# Altium schematic sheet Main.SchDoc
size Legal; Author: Mark & Qiming; DocumentNumber: 1; SheetNumber: 1; SheetTotal: 9
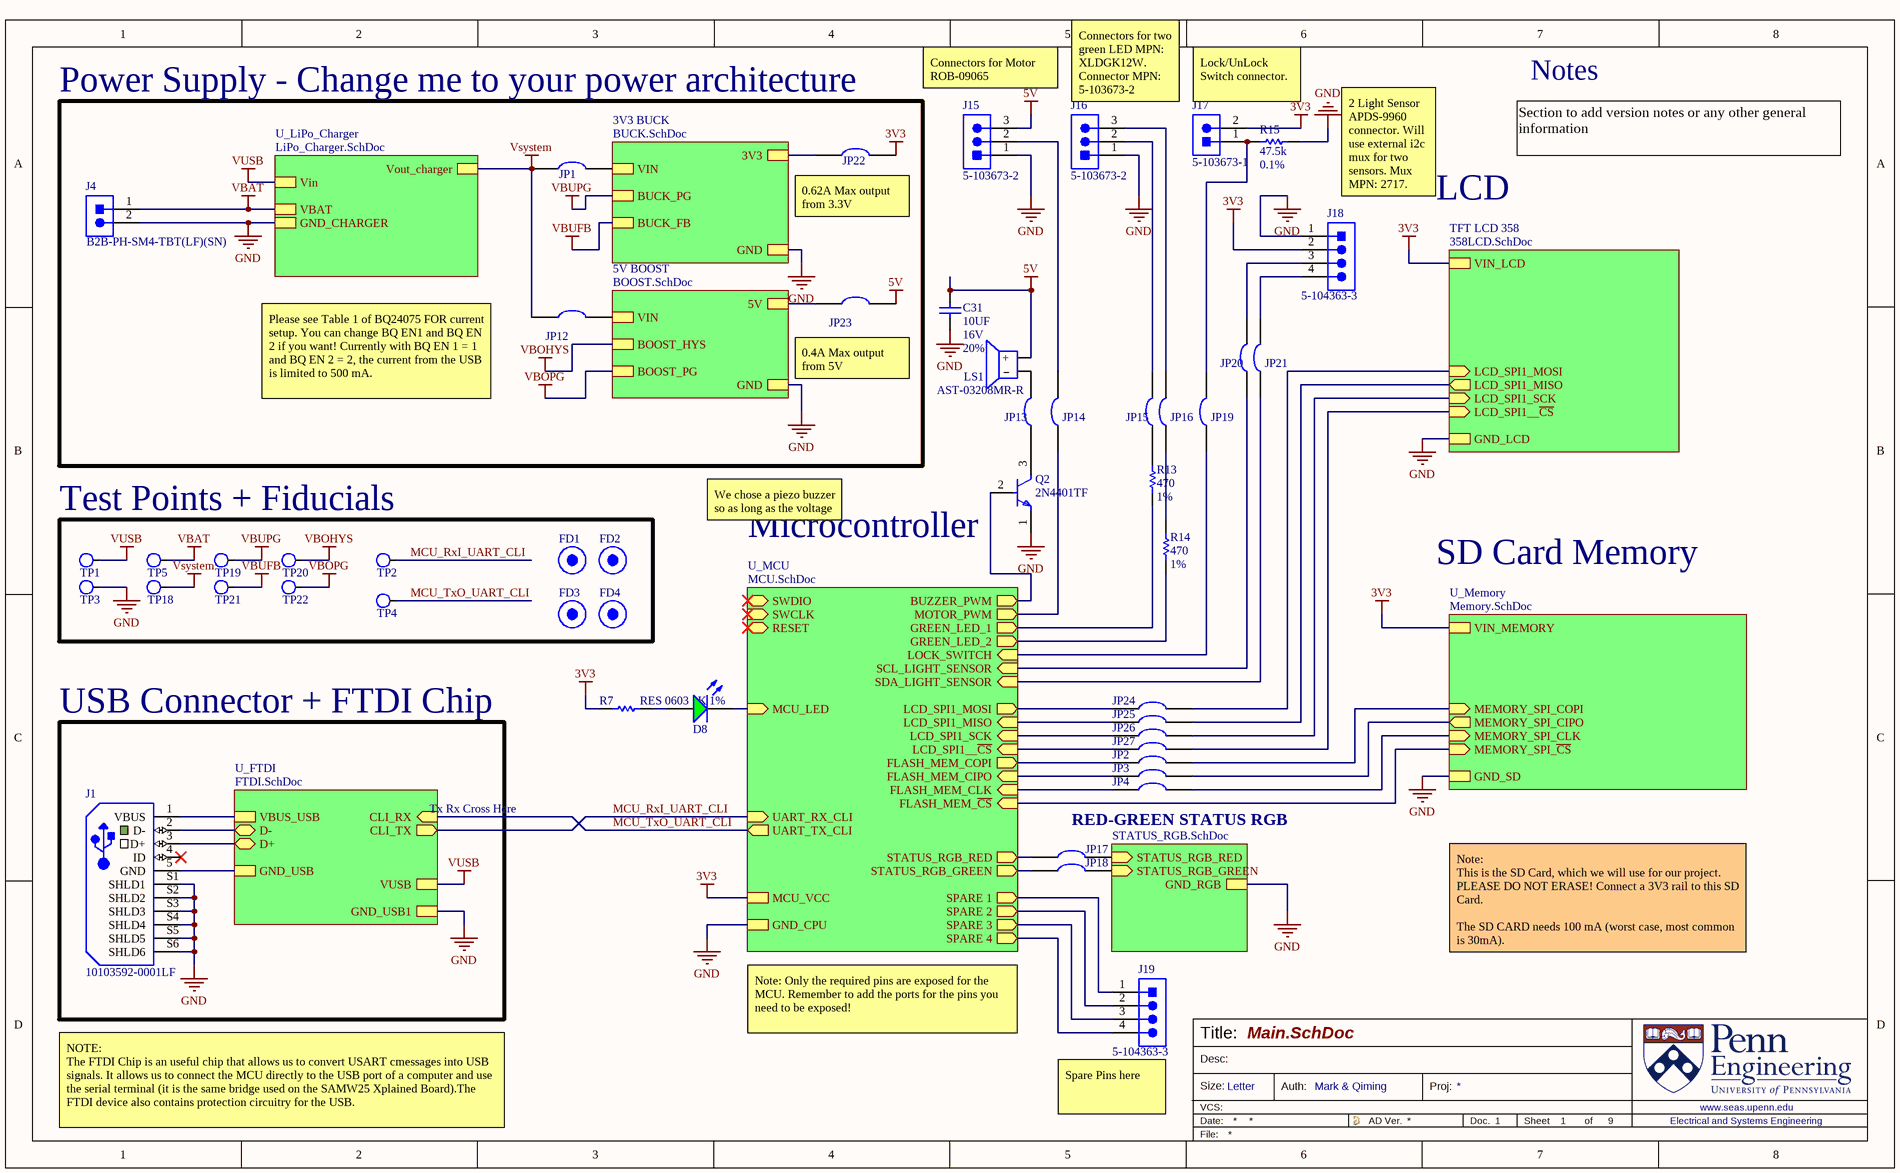
[diagram p0: Main.SchDoc]

## Parts
C31  value 10UF  Voltage: 16V  Tolerance: 20%  [0603_CAP]  (hidden comment: CAP 0603 10UF 16V 20% X5R)
D8  LSM0805452V  [LED_0805]  (value not drawn)
FD1  Fiducial 40x100mm  [Fiducial 40x100mm-Footprint-1]  (value not drawn)  (no BOM)
FD2  Fiducial 40x100mm  [Fiducial 40x100mm-Footprint-1]  (value not drawn)  (no BOM)
FD3  Fiducial 40x100mm  [Fiducial 40x100mm-Footprint-1]  (value not drawn)  (no BOM)
FD4  Fiducial 40x100mm  [Fiducial 40x100mm-Footprint-1]  (value not drawn)  (no BOM)
J1  10103592-0001LF  [10103592-0001LF-Footprint-1]
J4  B2B-PH-SM4-TBT(LF)(SN)  [FP-B2B-PH-SM4-TBT_LF_SN-MFG]
J15  5-103673-2  [5-103673-2-Footprint-1]
J16  5-103673-2  [5-103673-2-Footprint-1]
J17  5-103673-1  [5-103672-1-Footprint-1]
J18  5-104363-3  [5-104363-3-Footprint-1]
J19  5-104363-3  [5-104363-3-Footprint-1]
JP1  0603 link  [0603_JP_RES]  (value not drawn)  (net tie, no BOM)
JP2  0603 link  [0603_JP_RES]  (value not drawn)  (net tie, no BOM)
JP3  0603 link  [0603_JP_RES]  (value not drawn)  (net tie, no BOM)
JP4  0603 link  [0603_JP_RES]  (value not drawn)  (net tie, no BOM)
JP12  0603 link  [0603_JP_RES]  (value not drawn)  (net tie, no BOM)
JP13  0603 link  [0603_JP_RES]  (value not drawn)  (net tie, no BOM)
JP14  0603 link  [0603_JP_RES]  (value not drawn)  (net tie, no BOM)
JP15  0603 link  [0603_JP_RES]  (value not drawn)  (net tie, no BOM)
JP16  0603 link  [0603_JP_RES]  (value not drawn)  (net tie, no BOM)
JP17  0603 link  [0603_JP_RES]  (value not drawn)  (net tie, no BOM)
JP18  0603 link  [0603_JP_RES]  (value not drawn)  (net tie, no BOM)
JP19  0603 link  [0603_JP_RES]  (value not drawn)  (net tie, no BOM)
JP20  0603 link  [0603_JP_RES]  (value not drawn)  (net tie, no BOM)
JP21  0603 link  [0603_JP_RES]  (value not drawn)  (net tie, no BOM)
JP22  0603 link  [0603_JP_RES]  (value not drawn)  (net tie, no BOM)
JP23  0603 link  [0603_JP_RES]  (value not drawn)  (net tie, no BOM)
JP24  0603 link  [0603_JP_RES]  (value not drawn)  (net tie, no BOM)
JP25  0603 link  [0603_JP_RES]  (value not drawn)  (net tie, no BOM)
JP26  0603 link  [0603_JP_RES]  (value not drawn)  (net tie, no BOM)
JP27  0603 link  [0603_JP_RES]  (value not drawn)  (net tie, no BOM)
LS1  AST-03208MR-R  [AST-03208MR-R]
Q2  2N4401TF  [FP-135AR-MFG]
R7  RES 0603 1K 1%  [0603_RES]
R13  value 470  Tolerance: 1%  [0805_RES]  (hidden comment: RES 0805 470 1%)
R14  value 470  Tolerance: 1%  [0805_RES]  (hidden comment: RES 0805 470 1%)
R15  value 47.5k  Tolerance: 0.1%  [0805_RES]  (hidden comment: RES 0805 47.5K 0.1%)
TP1  Testpad  [SMT Testpoint, 50mil]  (value not drawn)  (no BOM)
TP2  Testpad  [SMT Testpoint, 50mil]  (value not drawn)  (no BOM)
TP3  Testpad  [SMT Testpoint, 50mil]  (value not drawn)  (no BOM)
TP4  Testpad  [SMT Testpoint, 50mil]  (value not drawn)  (no BOM)
TP5  Testpad  [Test PTH 27-50]  (value not drawn)  (no BOM)
TP18  Testpad  [Test PTH 27-50]  (value not drawn)  (no BOM)
TP19  Testpad  [SMT Testpoint, 50mil]  (value not drawn)  (no BOM)
TP20  Testpad  [SMT Testpoint, 50mil]  (value not drawn)  (no BOM)
TP21  Testpad  [SMT Testpoint, 50mil]  (value not drawn)  (no BOM)
TP22  Testpad  [SMT Testpoint, 50mil]  (value not drawn)  (no BOM)

## Blocks framed on the sheet
Power Supply - Change me to your power architecture: J4 JP1 JP12 JP22 JP23
Test Points + Fiducials: FD1-FD4 TP1-TP5 TP18-TP22
USB Connector + FTDI Chip: J1

## Sub-sheets
3V3 BUCK = BUCK.SchDoc: 3V3, VIN, BUCK_PG, BUCK_FB, GND
5V BOOST = BOOST.SchDoc: VIN, 5V, BOOST_HYS, BOOST_PG, GND
RED-GREEN STATUS RGB = STATUS_RGB.SchDoc: STATUS_RGB_RED (in), STATUS_RGB_GREEN (in), GND_RGB
TFT LCD 358 = 358LCD.SchDoc: LCD_SPI1_MOSI (in), LCD_SPI1_MISO (out), LCD_SPI1__~{CS} (in), LCD_SPI1_SCK (in), GND_LCD, VIN_LCD
U_FTDI = FTDI.SchDoc: CLI_RX (in), CLI_TX (out), VUSB, GND_USB1, VBUS_USB, D- (bidir), D+ (bidir), GND_USB
U_LiPo_Charger = LiPo_Charger.SchDoc: Vin, GND_CHARGER, VBAT, Vout_charger
U_MCU = MCU.SchDoc: SWDIO (bidir), SWCLK (in), UART_TX_CLI (out), UART_RX_CLI (in), RESET (bidir), MCU_LED (in), MCU_VCC, GND_CPU, FLASH_MEM_~{CS} (in), FLASH_MEM_CLK (in), FLASH_MEM_CIPO (in), FLASH_MEM_COPI (out), MOTOR_PWM (out), GREEN_LED_1 (out), GREEN_LED_2 (out), BUZZER_PWM (out), STATUS_RGB_GREEN (out), STATUS_RGB_RED (out), LOCK_SWITCH (in), SCL_LIGHT_SENSOR (in), SDA_LIGHT_SENSOR (in), LCD_SPI1_SCK (in), LCD_SPI1__~{CS} (in), LCD_SPI1_MOSI (out), LCD_SPI1_MISO (in), SPARE 1 (out), SPARE 2 (out), SPARE 3 (out), SPARE 4 (out)
U_Memory = Memory.SchDoc: MEMORY_SPI_COPI (in), MEMORY_SPI_CIPO (out), MEMORY_SPI_CLK (in), MEMORY_SPI_~{CS} (in), VIN_MEMORY, GND_SD

## Nets
3V3: J17.2 J18.2 JP22.2 R7.2 ; sheet U_MCU/MCU_VCC, sheet U_Memory/VIN_MEMORY, sheet TFT LCD 358/VIN_LCD
5V: C31.2 J15.3 JP23.2 LS1.1(+)
GND: C31.1 J1.S1(SHLD1) J1.S2(SHLD2) J1.S3(SHLD3) J1.S4(SHLD4) J1.S5(SHLD5) J1.S6(SHLD6) J4.2 J15.1 J16.1 J18.1 Q2.1(E) R15.2 TP3.1 ; sheet U_FTDI/GND_USB1, sheet U_MCU/GND_CPU, sheet U_LiPo_Charger/GND_CHARGER, sheet U_Memory/GND_SD, sheet 3V3 BUCK/GND, sheet 5V BOOST/GND, sheet RED-GREEN STATUS RGB/GND_RGB, sheet TFT LCD 358/GND_LCD
VBAT: J4.1 TP5.1 ; sheet U_LiPo_Charger/VBAT
VBOHYS: TP20.1 ; sheet 5V BOOST/BOOST_HYS
VBOPG: TP22.1 ; sheet 5V BOOST/BOOST_PG
VBUFB: TP21.1 ; sheet 3V3 BUCK/BUCK_FB
VBUPG: TP19.1 ; sheet 3V3 BUCK/BUCK_PG
Vsystem: JP1.1 JP12.1 TP18.1 ; sheet U_LiPo_Charger/Vout_charger
VUSB: TP1.1 ; sheet U_FTDI/VUSB, sheet U_LiPo_Charger/Vin
MCU_RxI_UART_CLI: TP2.1 ; sheet U_FTDI/CLI_TX, sheet U_MCU/UART_RX_CLI
MCU_TxO_UART_CLI: TP4.1 ; sheet U_FTDI/CLI_RX, sheet U_MCU/UART_TX_CLI
NetD8_A: D8.A R7.1
NetD8_K: D8.K ; sheet U_MCU/MCU_LED
NetJ1_1: J1.1(VBUS) ; sheet U_FTDI/VBUS_USB
NetJ1_2: J1.2(D-) ; sheet U_FTDI/D-
NetJ1_3: J1.3(D+) ; sheet U_FTDI/D+
NetJ1_5: J1.5(GND) ; sheet U_FTDI/GND_USB
NetJ15_2: J15.2 JP14.2
NetJ16_2: J16.2 JP15.2
NetJ16_3: J16.3 JP16.2
NetJ17_1: J17.1 JP19.2 R15.1
NetJ18_3: J18.3 JP20.2
NetJ18_4: J18.4 JP21.2
NetJ19_1: J19.1 ; sheet U_MCU/SPARE 1
NetJ19_2: J19.2 ; sheet U_MCU/SPARE 2
NetJ19_3: J19.3 ; sheet U_MCU/SPARE 3
NetJ19_4: J19.4 ; sheet U_MCU/SPARE 4
NetJP1_2: JP1.2 ; sheet 3V3 BUCK/VIN
NetJP2_1: JP2.1 ; sheet U_MCU/FLASH_MEM_COPI
NetJP2_2: JP2.2 ; sheet U_Memory/MEMORY_SPI_COPI
NetJP3_1: JP3.1 ; sheet U_MCU/FLASH_MEM_CIPO
NetJP3_2: JP3.2 ; sheet U_Memory/MEMORY_SPI_CIPO
NetJP4_1: JP4.1 ; sheet U_MCU/FLASH_MEM_CLK
NetJP4_2: JP4.2 ; sheet U_Memory/MEMORY_SPI_CLK
NetJP12_2: JP12.2 ; sheet 5V BOOST/VIN
NetJP13_1: JP13.1 Q2.3(C)
NetJP13_2: JP13.2 LS1.2(‒)
NetJP14_1: JP14.1 ; sheet U_MCU/MOTOR_PWM
NetJP15_1: JP15.1 R13.2
NetJP16_1: JP16.1 R14.2
NetJP17_1: JP17.1 ; sheet U_MCU/STATUS_RGB_RED
NetJP17_2: JP17.2 ; sheet RED-GREEN STATUS RGB/STATUS_RGB_RED
NetJP18_1: JP18.1 ; sheet U_MCU/STATUS_RGB_GREEN
NetJP18_2: JP18.2 ; sheet RED-GREEN STATUS RGB/STATUS_RGB_GREEN
NetJP19_1: JP19.1 ; sheet U_MCU/LOCK_SWITCH
NetJP20_1: JP20.1 ; sheet U_MCU/SCL_LIGHT_SENSOR
NetJP21_1: JP21.1 ; sheet U_MCU/SDA_LIGHT_SENSOR
NetJP22_1: JP22.1 ; sheet 3V3 BUCK/3V3
NetJP23_1: JP23.1 ; sheet 5V BOOST/5V
NetJP24_1: JP24.1 ; sheet U_MCU/LCD_SPI1_MOSI
NetJP24_2: JP24.2 ; sheet TFT LCD 358/LCD_SPI1_MOSI
NetJP25_1: JP25.1 ; sheet U_MCU/LCD_SPI1_MISO
NetJP25_2: JP25.2 ; sheet TFT LCD 358/LCD_SPI1_MISO
NetJP26_1: JP26.1 ; sheet U_MCU/LCD_SPI1_SCK
NetJP26_2: JP26.2 ; sheet TFT LCD 358/LCD_SPI1_SCK
NetJP27_1: JP27.1 ; sheet U_MCU/LCD_SPI1__~{CS}
NetJP27_2: JP27.2 ; sheet TFT LCD 358/LCD_SPI1__~{CS}
NetQ2_2: Q2.2(B) ; sheet U_MCU/BUZZER_PWM
NetR13_1: R13.1 ; sheet U_MCU/GREEN_LED_1
NetR14_1: R14.1 ; sheet U_MCU/GREEN_LED_2
(unnamed): sheet U_MCU/FLASH_MEM_~{CS}, sheet U_Memory/MEMORY_SPI_~{CS}

Not connected (* = marked no-connect by the designer): FD1 0(PAD); FD2 0(PAD); FD3 0(PAD); FD4 0(PAD); J1 4(ID)*

## Notes on the sheet
- Connectors for Motor ROB-09065
- (near J16) Connectors for two green LED MPN: XLDGK12W. Connector MPN: 5-103673-2
- Lock/UnLock Switch connector.
- Notes
- Section to add version notes or any other general information
- (near JP22) 0.62A Max output from 3.3V
- 2 Light Sensor APDS-9960 connector. Will use external i2c mux for two sensors. Mux MPN: 2717.
- LCD
- 0.4A Max output from 5V
- Please see Table 1 of BQ24075 FOR current setup. You can change BQ EN1 and BQ EN 2 if you want! Currently with BQ EN 1 = 1 and BQ EN 2 = 2, the current from the USB is limited to 500 mA.
- We chose a piezo buzzer so as long as the voltage is correct and we limit the current it should be good
- (near Q2) Microcontroller
- SD Card Memory
- Tx Rx Cross Here
- Note:
  This is the SD Card, which we will use for our project. PLEASE DO NOT ERASE! Connect a 3V3 rail to this SD Card.
  The SD CARD needs 100 mA (worst case, most common is 30mA).
- Note: Only the required pins are exposed for the MCU. Remember to add the ports for the pins you need to be exposed!
- NOTE:
  The FTDI Chip is an useful chip that allows us to convert USART cmessages into USB signals. It allows us to connect the MCU directly to the USB port of a computer and use the serial terminal (it is the same bridge used on the SAMW25 Xplained Board).The FTDI device also contains protection circuitry for the USB.
- (near J19) Spare Pins here
- Title:
- Desc:
- Size:
- Letter
- Auth:
- Proj:
- Sheet
- of
- www.seas.upenn.edu
- Electrical and Systems Engineering

## Library data of the parts
C31 = CMP-011-000263-1: Capacitor Surface Mount 0603 Footprint 10UF 16V 20% Tolerance Ceramic X5R; Manufacturer: Various; Description in Visual: Cap SMT 0603 10UF 16V 20% Ceramic X5R; PCB Package: 0603; Type: Ceramic X5R; Mount: SMT; P/N: CAP 0603 10UF 16V 20% X5R; Manufacturer P/N: CAP 0603 10UF 16V 20% X5R
D8 = CMP-00038-3: Single Color LED, Green, 0805; Test Current: 20mA; Forward Voltage: 2V; RoHS Compliant: Yes
FD1 FD3 FD4 = CMP-00085-3
FD2 = CMP-00085-2
J1 = CMP-00092-5: Conn Micro USB 2.0 Type B RCP 5 POS 0.65mm Solder RA SMD 5 Terminal 1 Port T/R
J4 = CMP-00418-1: Connector Header, PH Series, 2 Position, 2.00mm, 100V, Surface Mount, Solder, Pick and Place, Natural.
J15 J16 = CMP-00385-1: Board Connector, 3 Contact(s), 1 Row(s), Male, Right Angle, Solder Terminal, Black Insulator; Option: General Purpose; MIL Conformance: No; Number of Contacts: 3; Mating Information: MULTIPLE MATING PARTS AVAILABLE; Number of Rows Loaded: 1; Additional Feature: POLARIZED; Flammability Rating: UL94 V-0; RoHS Compliant: Yes; JESD-609 Code: e3; Contact Finish - Mating: NOT SPECIFIED; Reach SVHC Compliant: Yes; Connector Type: BOARD CONNECTOR; Filter Feature: No; IEC Conformance: No; Mounting Style: RIGHT ANGLE; Terminal Pitch: 2.54mm; Contact Material: Brass; Termination: Solder; Mounting Technology: Board; Mixed Contacts: No; Contact Finish - Termination: TIN; Contact Gender: Male; DIN Conformance: No
J17 = CMP-00384-1: Board Connector, 2 Contact(s), 1 Row(s), Male, Right Angle, 0.1 inch Pitch, Solder Terminal, Latch, Black Insulator, Receptacle; DIN Conformance: No; Rated Current (Signal): 3A; Number of Contacts: 2; Contact Pattern: RECTANGULAR; Body Depth: 0.535inch; Number Of PCB Rows: 1; Mating Information: MULTIPLE MATING PARTS AVAILABLE; Contact Style: SQ PIN-SKT; Option: General Purpose; Body Breadth: 0.275inch; Additional Feature: POLARIZED; Dielectric Withstanding Voltage (AC): 600V; Contact Resistance: 15mR; Plating Thickness: 15uin; Mounting Option 2: LOCKING; Reliability: COMMERCIAL; Body Length: 0.3inch; Insulation Resistance: 5GR; Board Mounting Option: HOLE .125-.137; Reference Standard: UL; Polarization Key: POLARIZED HOUSING; Min Operating Temperature: -65°C; Mating Contact Pitch: 0.1inch; Contact Gender: Male; Mounting Option 1: LATCH; Mounting Style: RIGHT ANGLE; Terminal Length: 0.13inch; Contact Material: Brass; PCB Contact Pattern: RECTANGULAR; JESD-609 Code: e3; Mounting Technology: Board; Body/Shell Style: RECEPTACLE; Contact Finish - Mating: NOT SPECIFIED; Number of Rows Loaded: 1; Termination: Solder; Terminal Pitch: 2.54mm; Contact Finish - Termination: TIN; IEC Conformance: No; Filter Feature: No; MIL Conformance: No; Reach SVHC Compliant: Yes; Number Of Connectors: 1; Insulation Material: Thermoplastic; Connector Type: BOARD CONNECTOR; Max Operating Temperature: 105°C; Mixed Contacts: No; Flammability Rating: UL94 V-0; Insulation Color: Black; RoHS Compliant: Yes
J18 J19 = CMP-00105-2: Board Connector, 4 Contact(s), 1 Row(s), Male, Straight, 0.1 inch Pitch, Solder Terminal, Locking, Black Insulator, Plug
JP1-JP4 JP12-JP27 = CMP-00422-2: 0O link, SMD, 0603, Solder Bridge Option; Manufacturer P/N: Various; Manufacturer: Generic; Description in Visual: 0O link, Solder Bridge/SMD, Open; Value: 0.025; Source: Shunts and Jumpers.SchLib; Pin Count: 2; Design Item ID: 0603 link; Component Type: Net Tie; P/N: 0603 link
LS1 = CMP-000049-2: 8 Ohms General Purpose Speaker 100 mW 500 Hz ~ 20 kHz Top Round
Q2 = CMP-00278-84408871-1: 2N4401TF Transistor General Purpose BJT NPN 40 Volt 0.6 Amp 3-Pin TO-92 Tape And Reel; Manufacturer Lifecycle Status: ACTIVE; Collector Emitter Voltage (VCEO): 40V; Max Frequency: 250MHz; Current Rating: 600mA; Element Configuration: Single; Max Power Dissipation: 625mW; Emitter Base Voltage (VEBO): 6V; Collector Emitter Saturation Voltage: 400mV; Max Junction Temperature (Tj): 150°C; Collector Base Voltage (VCBO): 60V; Number of Elements: 1; hFE Min: 100; Lifecycle Status: Production; Collector Emitter Breakdown Voltage: 40V; Lead Free: Lead Free; Gain Bandwidth Product: 250MHz; Number of Pins: 3; Length: 5.2mm; Case/Package: TO-92; RoHS: Compliant; Radiation Hardening: No; Height: 5.33mm; Schedule B: 8541210080, 8541210080; Voltage Rating (DC): 40V; REACH SVHC: No SVHC; Frequency: 250MHz; Width: 4.19mm; Power Dissipation: 625mW; Transition Frequency: 250MHz; Weight: 240mg; Mount: Through Hole; Polarity: NPN; Max Operating Temperature: 150°C; Min Operating Temperature: -55°C; NexarPartId: 84408871; Max Breakdown Voltage: 40V; Packaging: Tape and Reel; Max Collector Current: 600mA
R7 = CMP-005-002503-3: Resistor Surface Mount, 1K Ohms, 0603 Footprint, 1% Tolerance 0.1W; Manufacturer: Various; PCB Package: 0603; Description in Visual: Res SMT 1K 0603  1%  0.1W; Tolerance: 1%; Value: 1k; Mount: SMT; Power Rating: 0.1W; Manufacturer P/N: RES 0603 1K 1%; JLCPCB Part #: C21190
R13 R14 = CMP-005-005142-2: Resistor Surface Mount, 470 Ohms, 0805 Footprint, 1% Tolerance 0.125W; Manufacturer P/N: RES 0805 470R 1%; Manufacturer: Various; PCB Package: 0805; Description in Visual: Res SMT 470 0805  1%  0.125W; Power Rating: 0.125W; Mount: SMT
R15 = CMP-005-005139-2: Resistor Surface Mount, 47.5K Ohms, 0805 Footprint, 0.1% Tolerance 0.125W; Manufacturer: Various; PCB Package: 0805; Description in Visual: Res SMT 47.5K 0805  0.1%  0.125W; Mount: SMT; Power Rating: 0.125W; Manufacturer P/N: RES 0805 47.5K 0.1%
TP1-TP5 TP18-TP22 = CMP-00049-4: Test Pad/Point (Testpoint, Testpad), for probing